# Altium schematic sheet 01 - Arduino Shield.SchDoc
size A4; SheetNumber: 2; SheetTotal: 2
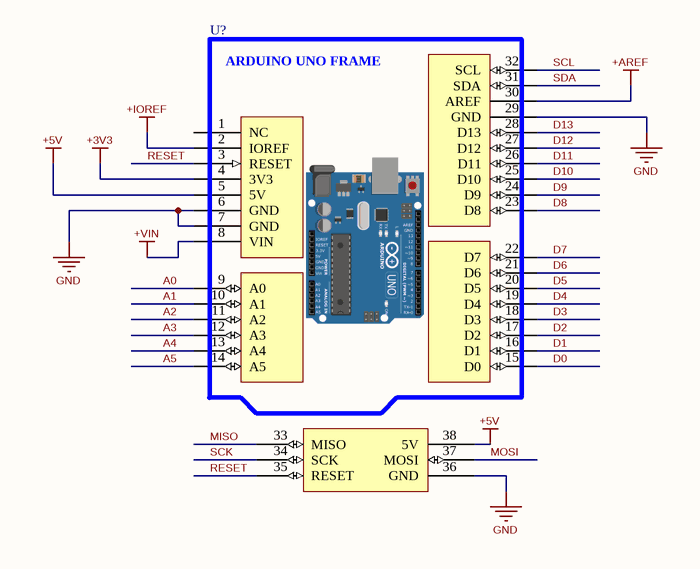
[diagram p0: 01 - Arduino Shield.SchDoc]

## Parts
U?  ARDUINO_UNO-FRAME-01  [ARDUINO_UNO_FRAME]  (value not drawn)  (no BOM)

## Nets
+3V3: U?.4(3V3)
+5V: U?.5(5V) U?.38(5V)
+AREF: U?.30(AREF)
+IOREF: U?.2(IOREF)
+VIN: U?.8(VIN)
GND: U?.6(GND) U?.7(GND) U?.29(GND) U?.36(GND)
A0: U?.9(A0)
A1: U?.10(A1)
A2: U?.11(A2)
A3: U?.12(A3)
A4: U?.13(A4)
A5: U?.14(A5)
D0: U?.15(D0)
D1: U?.16(D1)
D2: U?.17(D2)
D3: U?.18(D3)
D4: U?.19(D4)
D5: U?.20(D5)
D6: U?.21(D6)
D7: U?.22(D7)
D8: U?.23(D8)
D9: U?.24(D9)
D10: U?.25(D10)
D11: U?.26(D11)
D12: U?.27(D12)
D13: U?.28(D13)
MISO: U?.33(MISO)
MOSI: U?.37(MOSI)
RESET: U?.3(RESET) U?.35(RESET)
SCK: U?.34(SCK)
SCL: U?.32(SCL)
SDA: U?.31(SDA)

Not connected (* = marked no-connect by the designer): U? 1(NC)

## Notes on the sheet
- (in symbol Arduino_Uno-Frame-01) ARDUINO UNO FRAME

## Library data of the parts
U? = Arduino_Uno-Frame-01: _Creator: HoP; _Checked_SCH: HoP; _Checked_PCB: *; _SYM_REF: ARDUINO_UNO-FRAME-01; MFG: *; MFG PN: *; Value: *